# Altium project gps&&gprs.PrjPCB
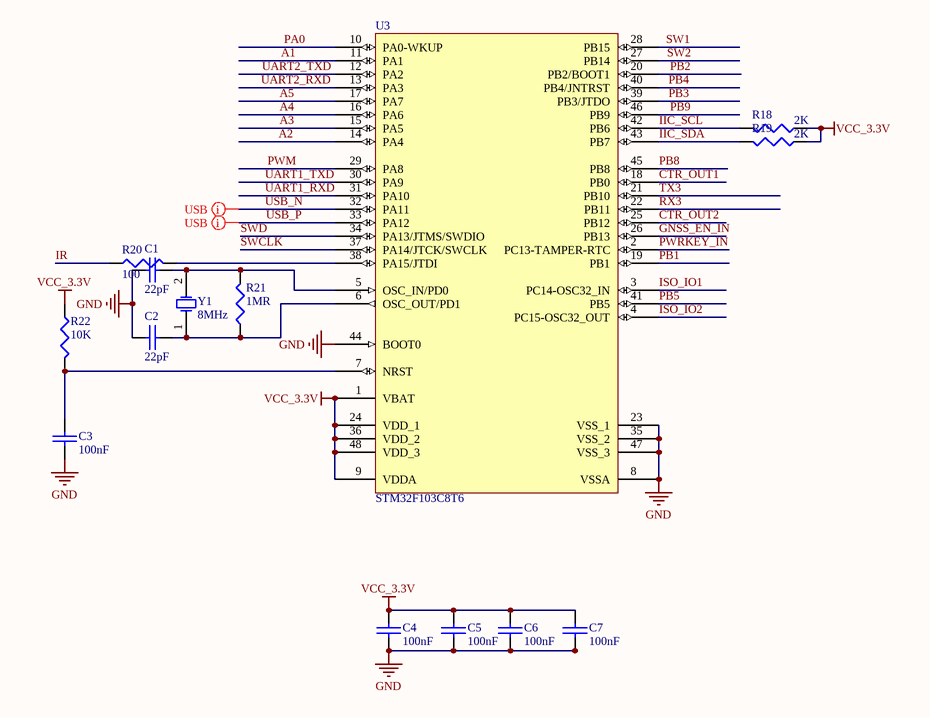
[diagram p0: cpu.SchDoc]
4 sheets, 86 parts. Net scope: global (net labels, ports and power ports of the same name join across sheets).
Board file: PCB1.PcbDoc
Sheets:
  cpu.SchDoc
  POWER.SchDoc
  Connector.SchDoc
  GSM.SchDoc

## Sheet cpu.SchDoc
size A4

### Parts
C1  22pF  [0402C]
C2  22pF  [0402C]
C3  100nF  [0402C]
C4  100nF  [0402C]
C5  100nF  [0402C]
C6  100nF  [0402C]
C7  100nF  [0402C]
R18  2K  [0402R]
R19  2K  [0402R]
R20  100  [0402R]
R21  1MR  [0402R]
R22  10K  [0402R]
U3  STM32F103C8T6  [TQFP-48]
Y1  8MHz  [CRAY_5032]

### Nets
GND: C1.1 C2.1 C3.1 C4.1 C5.1 C6.1 C7.1 U3.8(VSSA) U3.23(VSS_1) U3.35(VSS_2) U3.44(BOOT0) U3.47(VSS_3)
VCC_3.3V: C4.2 C5.2 C6.2 C7.2 R18.1 R19.1 R22.1 U3.1(VBAT) U3.9(VDDA) U3.24(VDD_1) U3.36(VDD_2) U3.48(VDD_3)
A1: U3.11(PA1)
A2: U3.14(PA4)
A3: U3.15(PA5)
A4: U3.16(PA6)
A5: U3.17(PA7)
CTR_OUT1: U3.18(PB0)
CTR_OUT2: U3.25(PB12)
GNSS_EN_IN: U3.26(PB13)
IIC_SCL: R18.2 U3.42(PB6)
IIC_SDA: R19.2 U3.43(PB7)
IR: R20.1
ISO_IO1: U3.3(PC14-OSC32_IN)
ISO_IO2: U3.4(PC15-OSC32_OUT)
PA0: U3.10(PA0-WKUP)
PB1: U3.19(PB1)
PB2: U3.20(PB2/BOOT1)
PB3: U3.39(PB3/JTDO)
PB4: U3.40(PB4/JNTRST)
PB5: U3.41(PB5)
PB8: U3.45(PB8)
PB9: U3.46(PB9)
PWM: U3.29(PA8)
PWRKEY_IN: U3.2(PC13-TAMPER-RTC)
RX3: U3.22(PB11)
SW1: U3.28(PB15)
SW2: U3.27(PB14)
SWCLK: U3.37(PA14/JTCK/SWCLK)
SWD: U3.34(PA13/JTMS/SWDIO)
TX3: U3.21(PB10)
UART1_RXD: U3.31(PA10)
UART1_TXD: U3.30(PA9)
UART2_RXD: U3.13(PA3)
UART2_TXD: U3.12(PA2)
USB_N: U3.32(PA11)
USB_P: U3.33(PA12)
NetC1_2: C1.2 R21.2 U3.5(OSC_IN/PD0) Y1.2(OSC2)
NetC2_2: C2.2 R21.1 U3.6(OSC_OUT/PD1) Y1.1(OSC1)
NetC3_2: C3.2 R22.2 U3.7(NRST)
NetR20_2: R20.2 U3.38(PA15/JTDI)

### Layout directives
differential pair: USB_N, USB_P

### Library data of the parts
C1-C7 = CAP: Capacitor
R18-R22 = Res3: Resistor; Published: 8-Jun-2000; LatestRevisionDate: 29-May-2009; LatestRevisionNote: IPC-7351 Footprint Added.; PackageReference: J1-0603; Publisher: Altium Limited; PackageDescription: Chip Resistor
U3 = STM32F103C8T6: STM32 ARM-based 32-bit MCU with 64 Kbytes Flash, 48-pin LQFP, Industrial Temperature; Published: 30-May-2008; DatasheetVersion: rev6, Mar-2008; PackageVersion: Mar-2008; PackageReference: LQFP48; Publisher: Altium Limited; PackageDescription: 48-Pin Low-Profile Quad Flat Pack, 7 x 7 mm Body, 0.5 mm Pitch (LQFP48); ComponentLink1Description: Manufacturer Link; ComponentLink1URL: www.st.com/stm32; ComponentLink2Description: Datasheet; ComponentLink2URL: http://www.st.com/stonline/products/literature/ds/13587.pdf
Y1 = XTAL: Crystal Oscillator; Published: 8-Jun-2000; LatestRevisionDate: 17-Jul-2002; LatestRevisionNote: Re-released for DXP Platform.; PackageReference: R38; Publisher: Altium Limited; PackageDescription: Crystal, Thru-Hole; 2 Leads; Body 3.1 x 8.2 mm (Dia.xH)

## Sheet POWER.SchDoc
size A3
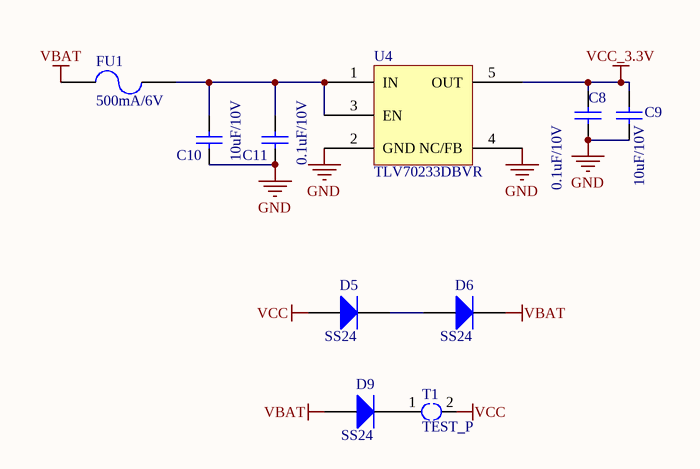
[diagram p1: POWER.SchDoc]

### Parts
C8  0.1uF/10V  [0402C]
C9  10uF/10V  [0603C]
C10  10uF/10V  [0603C]
C11  0.1uF/10V  [0402C]
D5  SS24  [SMA]
D6  SS24  [SMA]
D9  SS24  [SMA]
FU1  500mA/6V  [0805R]
T1  TEST_P  [TP_High PWR]
U4  TLV70233DBVR  [SOT23-5(DBV)]

### Nets
GND: C8.2 C9.1 C10.1 C11.2 U4.2(GND) U4.4(NC/FB)
VBAT: D6.2(K) D9.1(A) FU1.1
VCC: D5.1(A) T1.2
VCC_3.3V: C8.1 C9.2 U4.5(OUT)
NetC10_2: C10.2 C11.1 FU1.2 U4.1(IN) U4.3(EN)
NetD5_2: D5.2(K) D6.1(A)
NetD9_2: D9.2(K) T1.1

### Library data of the parts
C8 C11 = Cap: Capacitor; Value: 104; Published: 8-Jun-2000; LatestRevisionDate: 17-Jul-2002; LatestRevisionNote: Re-released for DXP Platform.; PackageReference: RAD-0.3; Publisher: Altium Limited
C9 = Cap: Capacitor; Published: 8-Jun-2000; LatestRevisionDate: 17-Jul-2002; LatestRevisionNote: Re-released for DXP Platform.; PackageReference: RAD-0.3; Publisher: Altium Limited; Value: 10uF/10V
C10 = Cap: Capacitor; Value: 106/50V; Published: 8-Jun-2000; LatestRevisionDate: 17-Jul-2002; LatestRevisionNote: Re-released for DXP Platform.; PackageReference: RAD-0.3; Publisher: Altium Limited
D5 D6 D9 = Diode 1N4148: High Conductance Fast Diode; Published: 8-Jun-2000; LatestRevisionDate: 17-Jul-2002; LatestRevisionNote: Re-released for DXP Platform.; DatasheetVersion: 1997; PackageReference: DO-35; Publisher: Altium Limited; Code_JEDEC: DO-204-AH; ComponentLink1Description: Manufacturer Link; ComponentLink1URL: http://www.fairchildsemi.com/; ComponentLink2Description: Datasheet; ComponentLink2URL: http://www.fairchildsemi.com/ds/1N%2F1N4148.pdf
FU1 = FUSE2: Fuse
U4 = TLV70230DBVR

## Sheet Connector.SchDoc
size A3
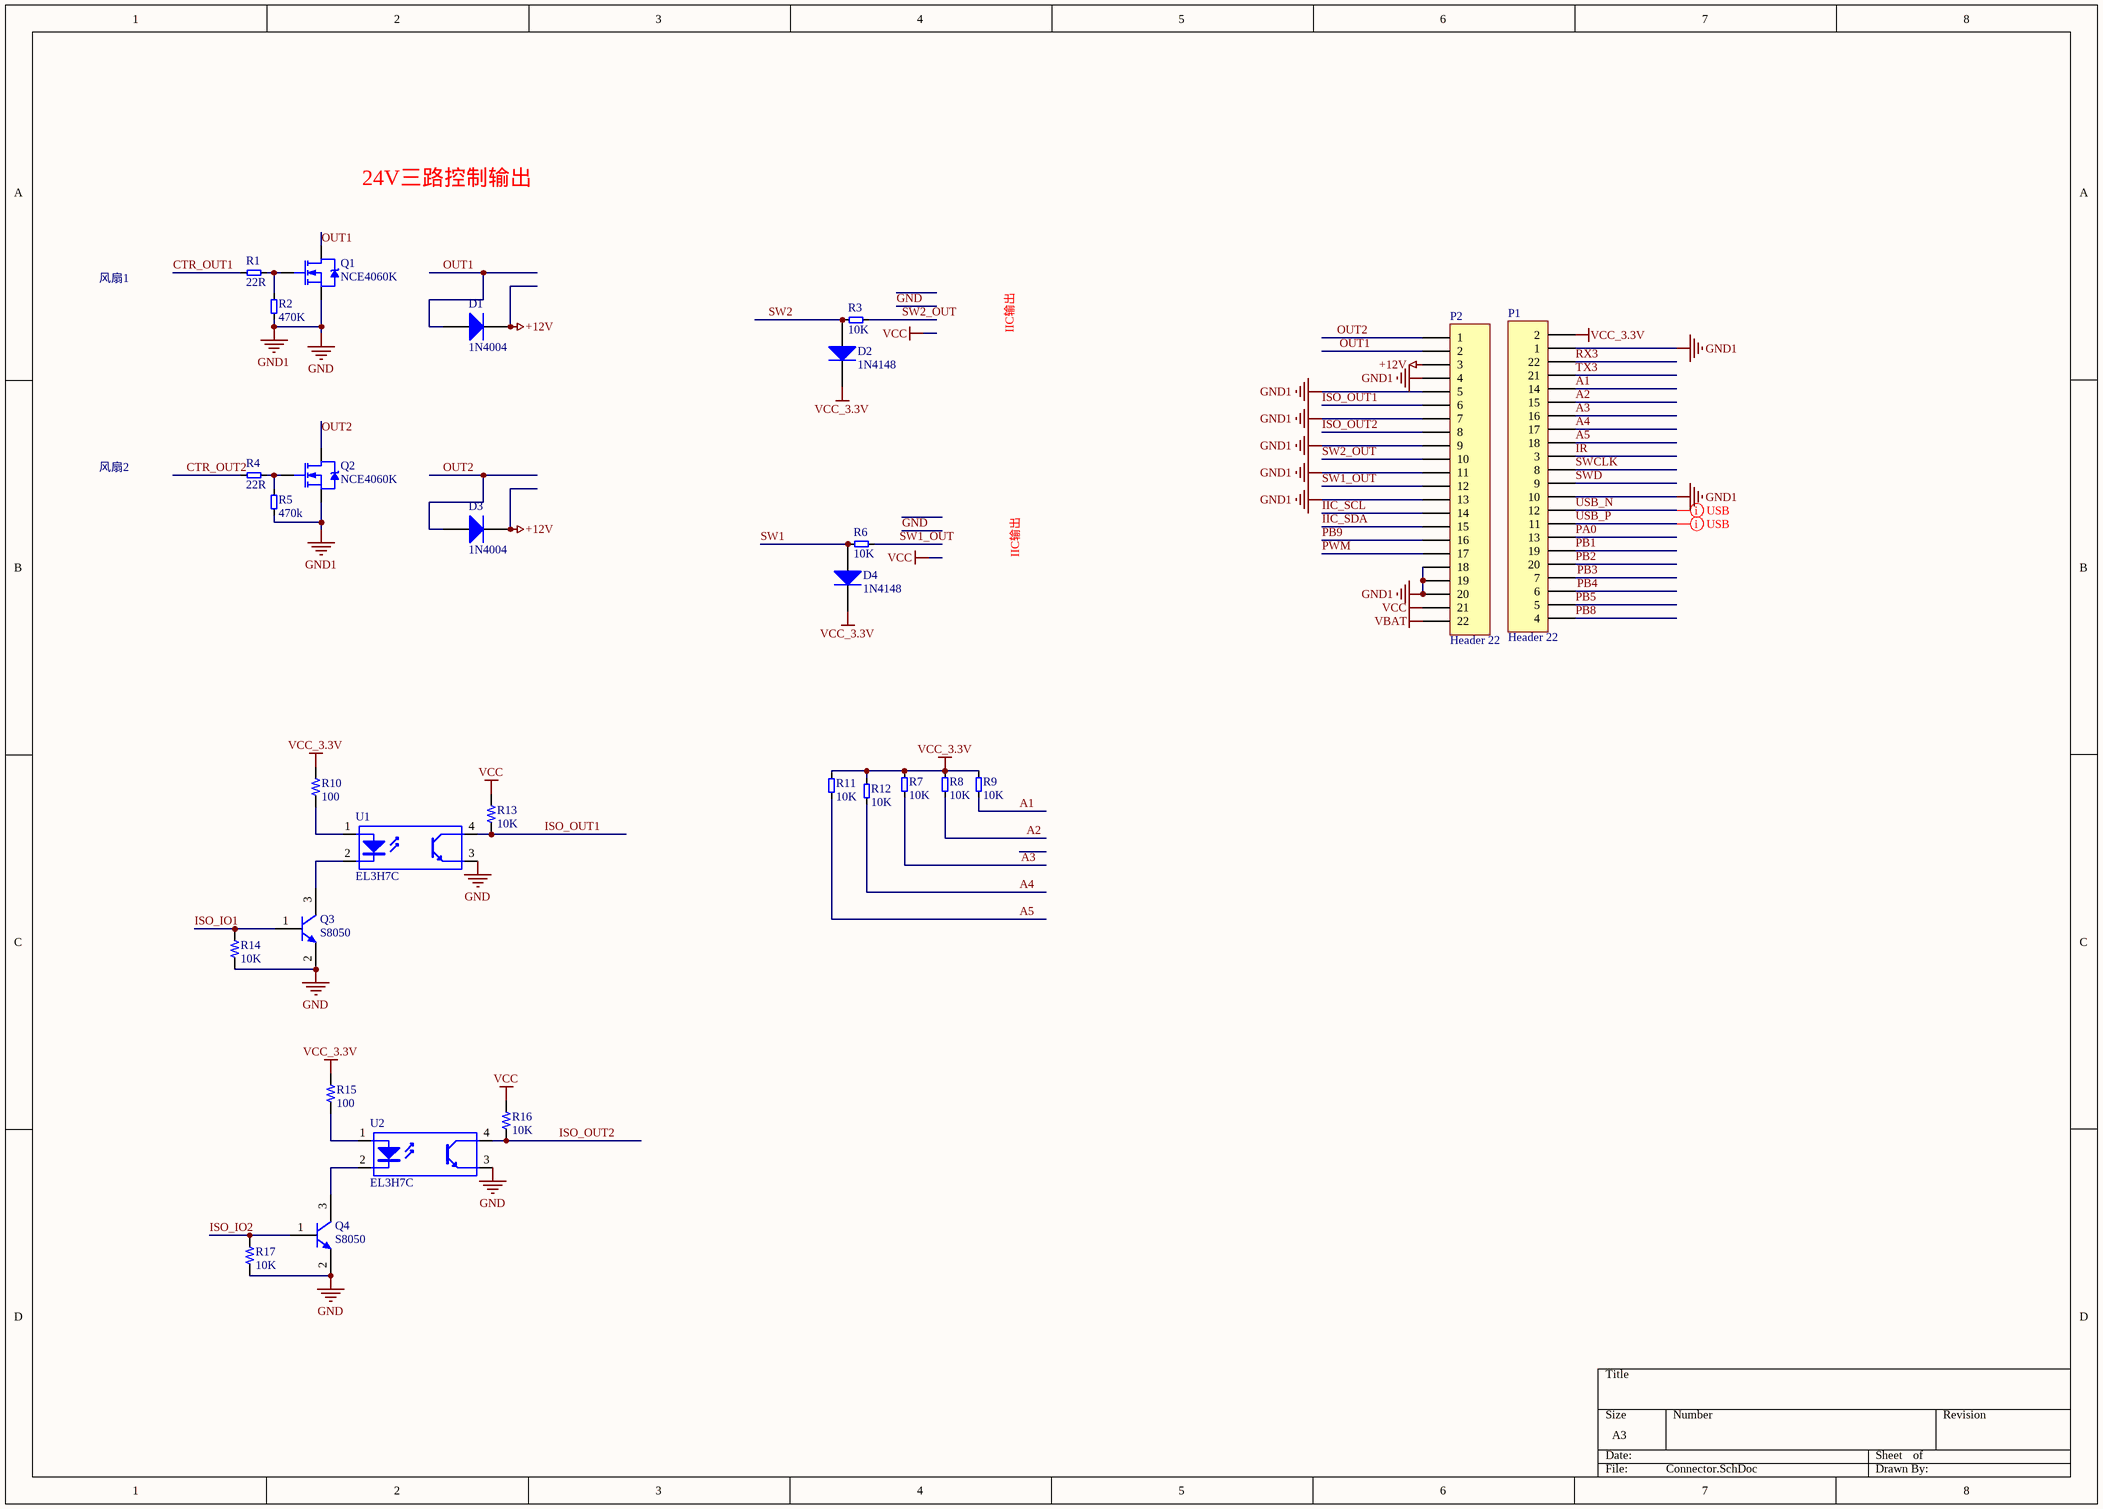
[diagram p2: Connector.SchDoc]

### Parts
D1  1N4004  [SMA]
D2  1N4148  [sod323]
D3  1N4004  [SMA]
D4  1N4148  [sod323]
P1  Header 22  [pcb_module_a]
P2  Header 22  [pcb_module_a]
Q1  NCE4060K  [TO-252-3S]
Q2  NCE4060K  [TO-252-3S]
Q3  S8050  [SOT23-3]
Q4  S8050  [SOT23-3]
R1  22R  [0402R]
R2  470K  [0402R]
R3  10K  [0402R]
R4  22R  [0402R]
R5  470k  [0402R]
R6  10K  [0402R]
R7  10K  [0402R]
R8  10K  [0402R]
R9  10K  [0402R]
R10  100  [0402R]
R11  10K  [0402R]
R12  10K  [0402R]
R13  10K  [0402R]
R14  10K  [0402R]
R15  100  [0402R]
R16  10K  [0402R]
R17  10K  [0402R]
U1  EL3H7C  [EL3H7C]
U2  EL3H7C  [EL3H7C]

### Nets
+12V: D1.2(K) D3.2(K) P2.3
GND: P1.1 P1.10 P2.4 P2.5 P2.7 P2.9 P2.11 P2.13 P2.18 P2.19 P2.20 Q1.3(S) Q2.3(S) Q3.2(E) Q4.2(E) R2.1 R5.1 R14.1 R17.1 U1.3(E) U2.3(E)  [also labelled GND1]
VBAT: P2.22
VCC: P2.21 R13.2 R16.2
VCC_3.3V: D2.K D4.K P1.2 R7.2 R8.2 R9.2 R10.2 R11.2 R12.1 R15.2
A1: P1.14 R9.1
A2: P1.15 R8.1
A3: P1.16 R7.1
A4: P1.17 R12.2
A5: P1.18 R11.1
CTR_OUT1: R1.1
CTR_OUT2: R4.1
IIC_SCL: P2.14
IIC_SDA: P2.15
IR: P1.3
ISO_IO1: Q3.1(B) R14.2
ISO_IO2: Q4.1(B) R17.2
ISO_OUT1: P2.6 R13.1 U1.4(C)
ISO_OUT2: P2.8 R16.1 U2.4(C)
OUT1: D1.1(A) P2.2 Q1.2(D)
OUT2: D3.1(A) P2.1 Q2.2(D)
PA0: P1.13
PB1: P1.19
PB2: P1.20
PB3: P1.7
PB4: P1.6
PB5: P1.5
PB8: P1.4
PB9: P2.16
PWM: P2.17
RX3: P1.22
SW1: D4.A R6.2
SW1_OUT: P2.12 R6.1
SW2: D2.A R3.2
SW2_OUT: P2.10 R3.1
SWCLK: P1.8
SWD: P1.9
TX3: P1.21
USB_N: P1.12
USB_P: P1.11
NetQ1_1: Q1.1(G) R1.2 R2.2
NetQ2_1: Q2.1(G) R4.2 R5.2
NetQ3_3: Q3.3(C) U1.2(K)
NetQ4_3: Q4.3(C) U2.2(K)
NetR10_1: R10.1 U1.1(A)
NetR15_1: R15.1 U2.1(A)

### Layout directives
differential pair: USB_N, USB_P

### Notes on the sheet
- 24V三路控制输出
- 风扇1
- IIC输出
- 风扇2

### Library data of the parts
D1 D3 = Diode_2: Default Diode; Published: 8-Jun-2000; LatestRevisionDate: 17-Jul-2002; LatestRevisionNote: Re-released for DXP Platform.; PackageVersion: Sep-1996; PackageReference: SMC; Publisher: Altium Limited; PackageDescription: DO-214-AB/SMC; 2 C-Bend Leads; Body 7.9 x 5.9 mm, inc. leads (LxW); Code_JEDEC: DO-214-AB
D2 D4 = Diode: Default Diode; Published: 8-Jun-2000; LatestRevisionDate: 17-Jul-2002; LatestRevisionNote: Re-released for DXP Platform.; PackageVersion: Sep-1996; PackageReference: SMC; Publisher: Altium Limited; Code_JEDEC: DO-214-AB
P1 P2 = Header 22: Header, 22-Pin; LatestRevisionDate: 17-Jul-2002; LatestRevisionNote: Re-released for DXP Platform.; Publisher: Altium Limited
Q1 Q2 = NCE4060K: NMOSFET
Q3 Q4 = NPN
R1-R9 R11 R12 = 1K: CR85-102J
R10 R13-R17 = R
U1 U2 = Optoisolator1: 4-Pin Phototransistor Optocoupler; Published: 24-Mar-1999; LatestRevisionDate: 04-Mar-2005; LatestRevisionNote: Sch pins 3 & 4 Swapped.; DatasheetVersion: Nov-2003; PackageReference: DIP-4; Publisher: Altium Limited

## Sheet GSM.SchDoc
size A3
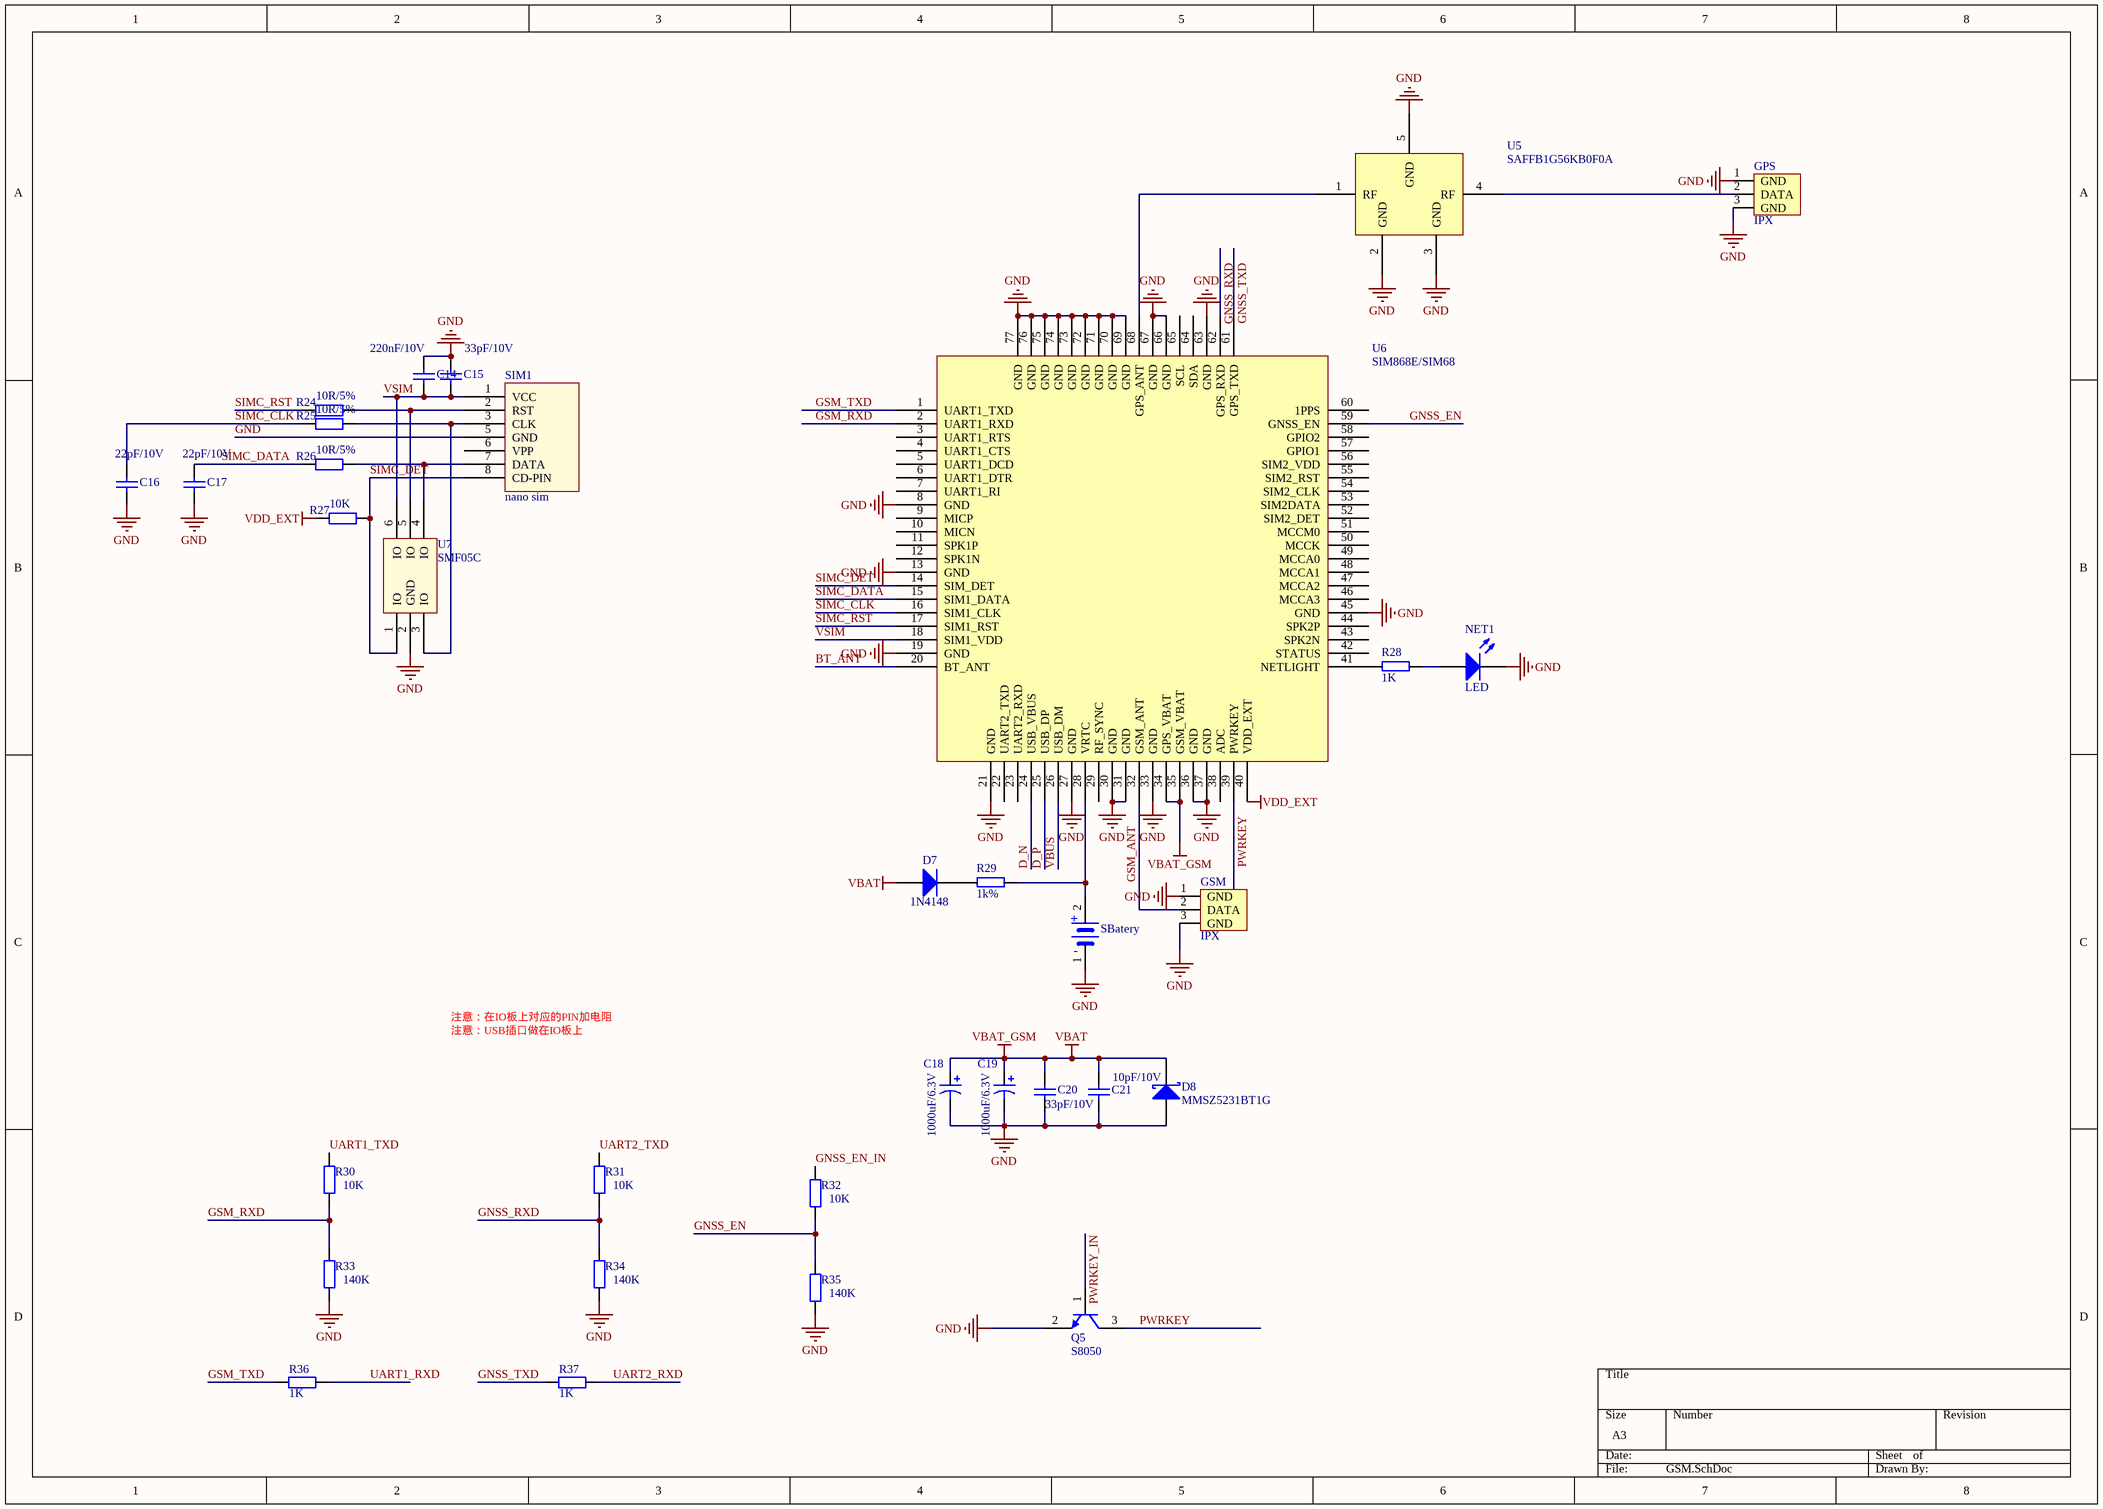
[diagram p3: GSM.SchDoc]

### Parts
C14  220nF/10V  [0402C]
C15  33pF/10V  [0402C]
C16  22pF/10V  [0402C]
C17  22pF/10V  [0402C]
C18  1000uF/6.3V  [7343]
C19  1000uF/6.3V  [7343]
C20  33pF/10V  [0402C]
C21  10pF/10V  [0402C]
D7  1N4148  [sod323]
D8  MMSZ5231BT1G  [SOD123]
GPS  IPX  [IPX]
GSM  IPX  [IPX]
NET1  LED  [0603LED]
Q5  S8050  [SOT23-3]
R24  10R/5%  [0402R]
R25  10R/5%  [0402R]
R26  10R/5%  [0402R]
R27  10K  [0402R]
R28  1K  [0402R]
R29  1k%  [0402R]
R30  10K  [0402R]
R31  10K  [0402R]
R32  10K  [0402R]
R33  140K  [0402R]
R34  140K  [0402R]
R35  140K  [0402R]
R36  1K  [0402R]
R37  1K  [0402R]
SBatery  SBatery  [MS621FE]  (value not drawn)
SIM1  nano sim  [Nano SIM]
U5  SAFFB1G56KB0F0A  [SAFFB1G56KB0F0A]
U6  SIM868E/SIM68  [SIM868]
U7  SMF05C  [SC70-6L]

### Nets
GND: C14.1 C15.1 C16.2 C17.2 C18.2 C19.2 C20.2 C21.2 D8.A GPS.1(GND) GPS.3(GND) GSM.1(GND) GSM.3(GND) NET1.2(K) Q5.2(E) R33.2 R34.2 R35.2 SBatery.1 SIM1.5(GND) U5.2(GND) U5.3(GND) U5.5(GND) U6.8(GND) U6.13(GND) U6.19(GND) U6.21(GND) U6.27(GND) U6.30(GND) U6.31(GND) U6.33(GND) U6.36(GND) U6.37(GND) U6.45(GND) U6.63(GND) U6.66(GND) U6.67(GND) U6.69(GND) U6.70(GND) U6.71(GND) U6.72(GND) U6.73(GND) U6.74(GND) U6.75(GND) U6.76(GND) U6.77(GND) U7.2(GND)
VBAT: C18.1 C19.1 C20.1 C21.1 D7.1(A) D8.K U6.34(GPS_VBAT) U6.35(GSM_VBAT)  [also labelled VBAT_GSM]
VDD_EXT: R27.2 U6.40(VDD_EXT)
BT_ANT: U6.20(BT_ANT)
D_N: U6.24(USB_VBUS)
D_P: U6.25(USB_DP)
GNSS_EN: R32.2 R35.1 U6.59(GNSS_EN)
GNSS_EN_IN: R32.1
GNSS_RXD: R31.2 R34.1 U6.62(GPS_RXD)
GNSS_TXD: R37.1 U6.61(GPS_TXD)
GSM_ANT: GSM.2(DATA) U6.32(GSM_ANT)
GSM_RXD: R30.2 R33.1 U6.2(UART1_RXD)
GSM_TXD: R36.1 U6.1(UART1_TXD)
PWRKEY: Q5.3(C) U6.39(PWRKEY)
PWRKEY_IN: Q5.1(B)
SIMC_CLK: C16.1 R25.2 U6.16(SIM1_CLK)
SIMC_DATA: C17.1 R26.2 U6.15(SIM1_DATA)
SIMC_DET: R27.1 SIM1.8(CD-PIN) U6.14(SIM_DET) U7.1(IO)
SIMC_RST: R24.2 U6.17(SIM1_RST)
UART1_RXD: R36.2
UART1_TXD: R30.1
UART2_RXD: R37.2
UART2_TXD: R31.1
VBUS: U6.26(USB_DM)
VSIM: C14.2 C15.2 SIM1.1(VCC) U6.18(SIM1_VDD) U7.6(IO)
NetD7_2: D7.2(K) R29.2
NetGPS_2: GPS.2(DATA) U5.4(RF)
NetNET1_1: NET1.1(A) R28.1
NetR24_1: R24.1 SIM1.2(RST) U7.5(IO)
NetR25_1: R25.1 SIM1.3(CLK) U7.3(IO)
NetR26_1: R26.1 SIM1.7(DATA) U7.4(IO)
NetR28_2: R28.2 U6.41(NETLIGHT)
NetR29_1: R29.1 SBatery.2 U6.28(VRTC)
NetU5_1: U5.1(RF) U6.68(GPS_ANT)

Not connected (* = marked no-connect by the designer): SIM1 6(VPP); U6 3(UART1_RTS) 4(UART1_CTS) 5(UART1_DCD) 6(UART1_DTR) 7(UART1_RI) 9(MICP) 10(MICN) 11(SPK1P) 12(SPK1N) 22(UART2_TXD) 23(UART2_RXD) 29(RF_SYNC) 38(ADC) 42(STATUS) 43(SPK2N) 44(SPK2P) 46(MCCA3) 47(MCCA2) 48(MCCA1) 49(MCCA0) 50(MCCK) 51(MCCM0) 52(SIM2_DET) 53(SIM2DATA) 54(SIM2_CLK) 55(SIM2_RST) 56(SIM2_VDD) 57(GPIO1) 58(GPIO2) 60(1PPS) 64(SDA) 65(SCL)

### Notes on the sheet
- 注意：在IO板上对应的PIN加电阻
- 注意：USB插口做在IO板上
- (in symbol SBatery) +; -

### Library data of the parts
C14-C17 C20 C21 = Cap: Capacitor; Value: 0.1uF/10V; Published: 8-Jun-2000; LatestRevisionDate: 17-Jul-2002; LatestRevisionNote: Re-released for DXP Platform.; PackageReference: RAD-0.3; Publisher: Altium Limited
C18 C19 = Cap Pol1: Polarized Capacitor (Radial); Published: 8-Jun-2000; LatestRevisionDate: 17-Jul-2002; LatestRevisionNote: Re-released for DXP Platform.; PackageReference: RB7.6-15; Publisher: Altium Limited
D7 = Diode 1N4148: High Conductance Fast Diode; Published: 8-Jun-2000; LatestRevisionDate: 17-Jul-2002; LatestRevisionNote: Re-released for DXP Platform.; DatasheetVersion: 1997; PackageReference: DO-35; Publisher: Altium Limited; Code_JEDEC: DO-204-AH; ComponentLink1Description: Manufacturer Link; ComponentLink1URL: http://www.fairchildsemi.com/; ComponentLink2Description: Datasheet; ComponentLink2URL: http://www.fairchildsemi.com/ds/1N%2F1N4148.pdf
D8 = Diode 10TQ040: Schottky Rectifier; Note: Terminal 2 is the TAB and is electrically connected to the cathode; Published: 8-Jun-2000; LatestRevisionDate: 17-Jul-2002; LatestRevisionNote: Re-released for DXP Platform.; DatasheetVersion: PD-2.057B; PackageVersion: Feb-1998; PackageReference: TO-220AC; Publisher: Altium Limited; ComponentLink1Description: Manufacturer Link; ComponentLink1URL: http://www.irf.com/
GPS GSM = IPEX: IPEX座
NET1 = LED2: Typical RED, GREEN, YELLOW, AMBER GaAs LED; Published: 8-Jun-2000; LatestRevisionDate: 17-Jul-2002; LatestRevisionNote: Re-released for DXP Platform.; PackageDocument: Feb-2002; PackageReference: 3.2X1.6X1.1; Publisher: Altium Limited
Q5 = NPN
R24-R27 = Res2: Resistor; Value: 10R; Published: 8-Jun-2000; LatestRevisionDate: 17-Jul-2002; LatestRevisionNote: Re-released for DXP Platform.; PackageReference: AXIAL-0.4; Publisher: Altium Limited
R28 R29 = R
R30-R37 = Res2: Resistor; Value: 0; Published: 8-Jun-2000; LatestRevisionDate: 17-Jul-2002; LatestRevisionNote: Re-released for DXP Platform.; PackageReference: AXIAL-0.4; Publisher: Altium Limited
U5 = SAFFB1G56KBOFA
U6 = SIM868E/SIM868

## Nets that join several sheets
GND: cpu (12 pins), POWER (6 pins), Connector (21 pins), GSM (47 pins)
VBAT: POWER (D6.2 D9.1 FU1.1), Connector (P2.22), GSM (8 pins)
VCC: POWER (D5.1 T1.2), Connector (P2.21 R13.2 R16.2)
VCC_3.3V: cpu (12 pins), POWER (C8.1 C9.2 U4.5), Connector (10 pins)
A1: cpu (U3.11), Connector (P1.14 R9.1)
A2: cpu (U3.14), Connector (P1.15 R8.1)
A3: cpu (U3.15), Connector (P1.16 R7.1)
A4: cpu (U3.16), Connector (P1.17 R12.2)
A5: cpu (U3.17), Connector (P1.18 R11.1)
CTR_OUT1: cpu (U3.18), Connector (R1.1)
CTR_OUT2: cpu (U3.25), Connector (R4.1)
GNSS_EN_IN: cpu (U3.26), GSM (R32.1)
IIC_SCL: cpu (R18.2 U3.42), Connector (P2.14)
IIC_SDA: cpu (R19.2 U3.43), Connector (P2.15)
IR: cpu (R20.1), Connector (P1.3)
ISO_IO1: cpu (U3.3), Connector (Q3.1 R14.2)
ISO_IO2: cpu (U3.4), Connector (Q4.1 R17.2)
PA0: cpu (U3.10), Connector (P1.13)
PB1: cpu (U3.19), Connector (P1.19)
PB2: cpu (U3.20), Connector (P1.20)
PB3: cpu (U3.39), Connector (P1.7)
PB4: cpu (U3.40), Connector (P1.6)
PB5: cpu (U3.41), Connector (P1.5)
PB8: cpu (U3.45), Connector (P1.4)
PB9: cpu (U3.46), Connector (P2.16)
PWM: cpu (U3.29), Connector (P2.17)
PWRKEY_IN: cpu (U3.2), GSM (Q5.1)
RX3: cpu (U3.22), Connector (P1.22)
SW1: cpu (U3.28), Connector (D4.A R6.2)
SW2: cpu (U3.27), Connector (D2.A R3.2)
SWCLK: cpu (U3.37), Connector (P1.8)
SWD: cpu (U3.34), Connector (P1.9)
TX3: cpu (U3.21), Connector (P1.21)
UART1_RXD: cpu (U3.31), GSM (R36.2)
UART1_TXD: cpu (U3.30), GSM (R30.1)
UART2_RXD: cpu (U3.13), GSM (R37.2)
UART2_TXD: cpu (U3.12), GSM (R31.1)
USB_N: cpu (U3.32), Connector (P1.12)
USB_P: cpu (U3.33), Connector (P1.11)